# EAGLE schematic XoverVolume (EAGLE 7.3.0)
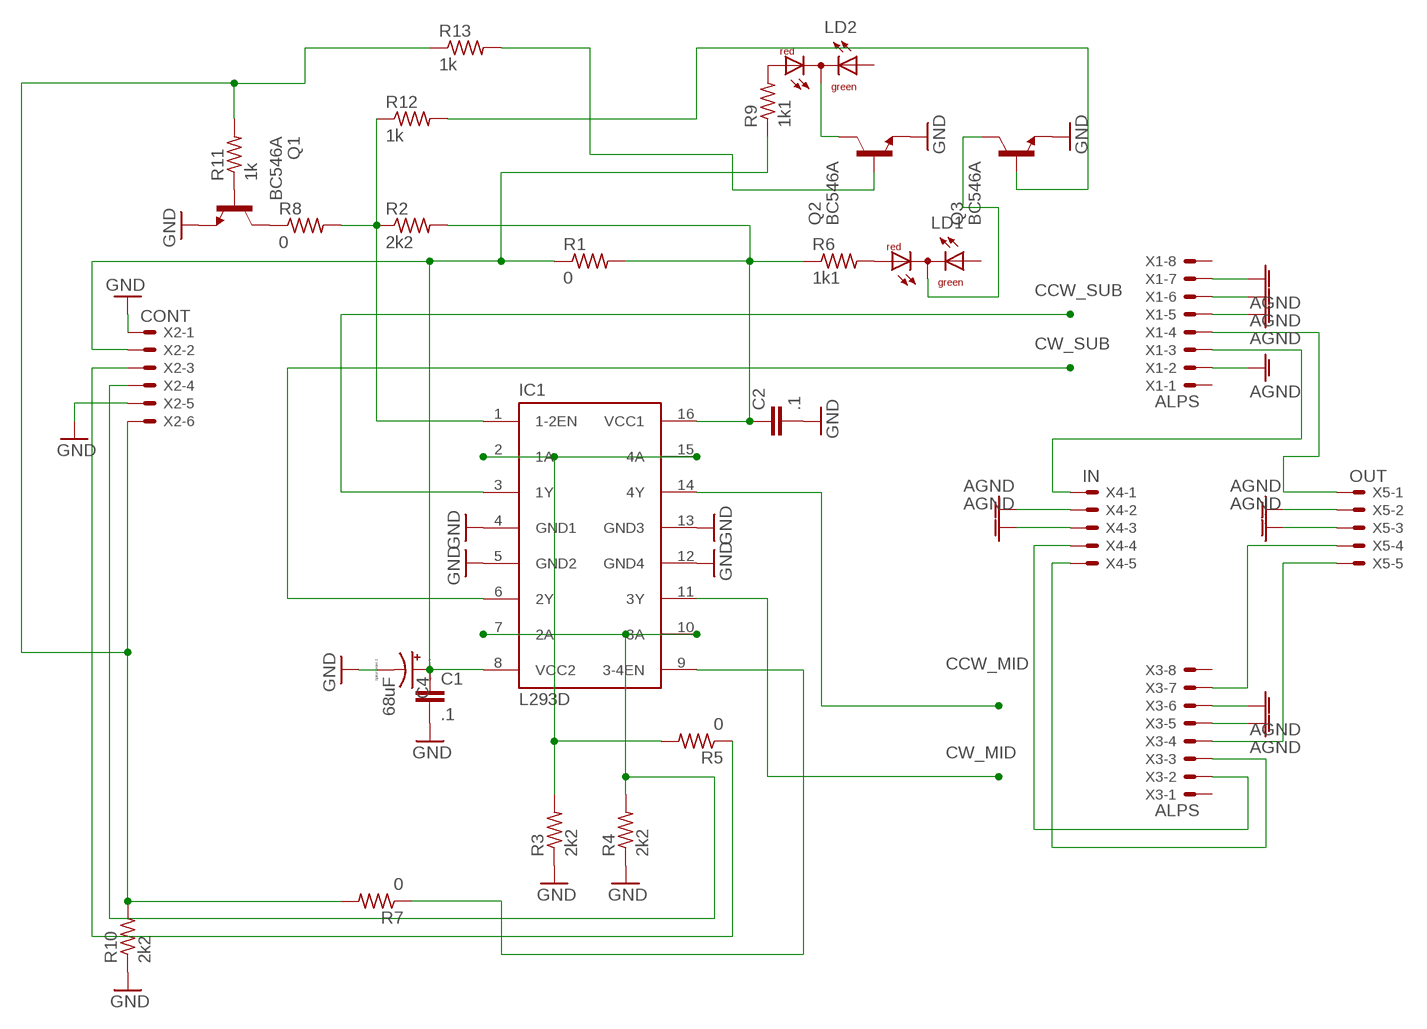
[diagram p0: schematic, sheet 1]

## Parts
C1  .1  C-EUC1210  [C1210]
C2  .1  C-EUC1210  [C1210]
C4  68uF  CPOL-USE2,5-6E  [E2,5-6E]
IC1  L293D  [DIL16]
LD1  DUOLED-RG-C  [DUOLED-C-5MM]
LD2  DUOLED-RG-C  [DUOLED-C-5MM]
Q1  BC546A  [TO92-EBC]
Q2  BC546A  [TO92-EBC]
Q3  BC546A  [TO92-EBC]
R1  0  R-US_0207/15  [0207/15]
R2  2k2  R-US_R1210  [R1210]
R3  2k2  R-US_R1210  [R1210]
R4  2k2  R-US_R1210  [R1210]
R5  0  R-US_0309/12  [0309/12]
R6  1k1  R-US_0309/12  [0309/12]
R7  0  R-US_0309/12  [0309/12]
R8  0  R-US_0207/15  [0207/15]
R9  1k1  R-US_0309/12  [0309/12]
R10  2k2  R-US_R1210  [R1210]
R11  1k  R-US_0207/5V  [0207/5V]
R12  1k  R-US_0204/5  [0204/5]
R13  1k  R-US_R1210  [R1210]
X1  ALPS  22-23-2081  [22-23-2081]
X2  CONT  22-23-2061  [22-23-2061]
X3  ALPS  22-23-2081  [22-23-2081]
X4  IN  22-23-2051  [22-23-2051]
X5  OUT  22-23-2051  [22-23-2051]

## Nets
AGND: X1.2 X1.5 X1.6 X1.7 X3.5 X3.6 X4.2 X4.3 X5.2 X5.3
CCW_MID: IC1.14(4Y)
CCW_SUB: IC1.3(1Y)
CW_MID: IC1.11(3Y)
CW_SUB: IC1.6(2Y)
GND: C1.2 C2.2 C4.- IC1.4(GND1) IC1.5(GND2) IC1.12(GND4) IC1.13(GND3) Q1.E Q2.E Q3.E R3.1 R4.1 R10.1 X2.1 X2.5
N$1: IC1.7(2A) IC1.10(3A) R4.2 X2.4
N$2: IC1.2(1A) IC1.15(4A) R3.2 R5.2
N$3: R5.1 X2.3
N$4: R7.2 R10.2 R11.2 R13.1 X2.6
N$5: X1.3 X4.1
N$6: IC1.9(3-4EN) R7.1
N$7: IC1.1(1-2EN) R2.1 R8.2 R12.1
N$8: C1.1 C4.+ IC1.8(VCC2) R1.1 R9.1 X2.2
N$9: X1.4 X5.1
N$10: LD1.AR R6.2
N$11: C2.1 IC1.16(VCC1) R1.2 R2.2 R6.1
N$12: LD2.AR R9.2
N$13: X3.7 X5.4
N$14: Q1.C R8.1
N$15: Q1.B R11.1
N$16: X3.4 X5.5
N$17: X3.3 X4.5
N$18: X3.2 X4.4
N$19: Q3.B R12.2
N$20: LD2.C Q2.C
N$21: LD1.C Q3.C
N$22: Q2.B R13.2
Unconnected: LD1.AX(AG) LD2.AX(AG) X1.1 X1.8 X3.1 X3.8

## Library data of the parts
C1 C2 = resistor:C-EU: CAPACITOR, European symbol
C4 = resistor:CPOL-US: POLARIZED CAPACITOR, American symbol
IC1 = st-microelectronics:L293D: PUSH-PULL 4 CHANNEL DRIVER; MPN: L293D; OC_FARNELL: 9589619; OC_NEWARK: 56P8249
LD1 LD2 = led:DUOLED-RG-C: DUO LED 2 colors (red/green), 5 mm, round, common Cathode www.ligitek.com or other producers.
Q1-Q3 = transistor-npn:BC546*: NPN Transistor
R1-R13 = resistor:R-US_: RESISTOR, American symbol
X1 X3 = con-molex:22-23-2081: .100" (2.54mm) Center Header - 8 Pin; MF: MOLEX; MPN: 22-23-2081; OC_FARNELL: 1756826; OC_NEWARK: 01C7592
X2 = con-molex:22-23-2061: .100" (2.54mm) Center Header - 6 Pin; MF: MOLEX; MPN: 22-23-2061; OC_FARNELL: 1462922; OC_NEWARK: 27C1933
X4 X5 = con-molex:22-23-2051: .100" (2.54mm) Center Header - 5 Pin; MF: MOLEX; MPN: 22-23-2051; OC_FARNELL: 1462952; OC_NEWARK: 38C9178